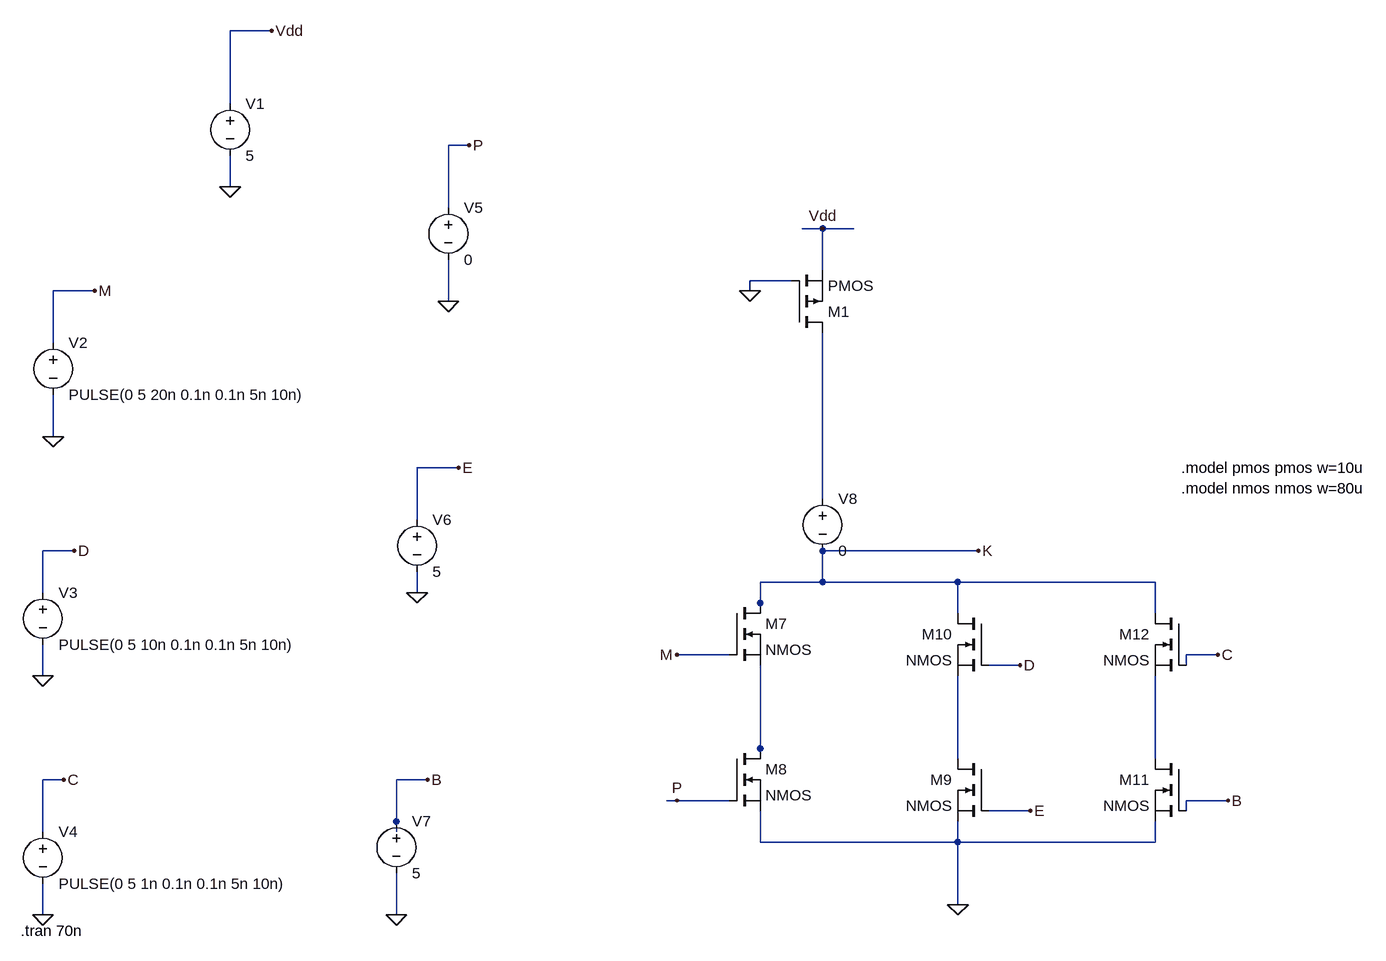
[diagram p0: schematic 5_1_2.asc]
5_1_2.asc, the LTspice schematic file:
Version 4
SHEET 1 892 808
WIRE -816 -592 -880 -592
WIRE -880 -480 -880 -592
WIRE -512 -416 -544 -416
WIRE -880 -352 -880 -400
WIRE -544 -320 -544 -416
WIRE 32 -288 0 -288
WIRE 80 -288 32 -288
WIRE 32 -224 32 -288
WIRE -16 -208 -80 -208
WIRE -1088 -192 -1152 -192
WIRE -80 -192 -80 -208
WIRE -544 -176 -544 -240
WIRE -1152 -112 -1152 -192
WIRE -1152 32 -1152 -32
WIRE -528 80 -592 80
WIRE 32 128 32 -128
WIRE -592 160 -592 80
WIRE -1120 208 -1168 208
WIRE 272 208 32 208
WIRE 32 256 32 208
WIRE 32 256 -64 256
WIRE 240 256 32 256
WIRE 544 256 240 256
WIRE -1168 272 -1168 208
WIRE -592 272 -592 240
WIRE -64 288 -64 256
WIRE -64 304 -64 288
WIRE 240 304 240 256
WIRE 544 304 544 256
WIRE -112 368 -192 368
WIRE 640 368 592 368
WIRE 336 384 288 384
WIRE 592 384 592 368
WIRE -1168 400 -1168 352
WIRE -64 512 -64 384
WIRE -64 528 -64 512
WIRE 240 528 240 400
WIRE 544 528 544 400
WIRE -1136 560 -1168 560
WIRE -576 560 -624 560
WIRE -192 592 -208 592
WIRE -112 592 -192 592
WIRE 656 592 592 592
WIRE 352 608 288 608
WIRE 592 608 592 592
WIRE -624 624 -624 560
WIRE -1168 640 -1168 560
WIRE -624 640 -624 624
WIRE -64 656 -64 608
WIRE 240 656 240 624
WIRE 240 656 -64 656
WIRE 544 656 544 624
WIRE 544 656 240 656
WIRE 240 752 240 656
WIRE -1168 768 -1168 720
WIRE -624 768 -624 704
FLAG 240 752 0
FLAG 272 208 Κ
FLAG -192 368 Μ
FLAG -192 592 P
FLAG 336 384 D
FLAG 352 608 E
FLAG 640 368 C
FLAG 656 592 B
FLAG -816 -592 Vdd
FLAG -880 -352 0
FLAG -1088 -192 M
FLAG -512 -416 P
FLAG -1120 208 D
FLAG -528 80 E
FLAG -1136 560 C
FLAG -576 560 B
FLAG -1168 768 0
FLAG -624 768 0
FLAG -592 272 0
FLAG -1168 400 0
FLAG -1152 32 0
FLAG -544 -176 0
FLAG 32 -288 Vdd
FLAG -80 -192 0
SYMBOL nmos -112 288 R0
SYMATTR InstName M7
SYMBOL nmos -112 512 R0
SYMATTR InstName M8
SYMBOL nmos 288 528 M0
SYMATTR InstName M9
SYMBOL nmos 288 304 M0
SYMATTR InstName M10
SYMBOL nmos 592 528 M0
SYMATTR InstName M11
SYMBOL nmos 592 304 M0
SYMATTR InstName M12
SYMBOL voltage -880 -496 R0
WINDOW 123 0 0 Left 0
WINDOW 39 0 0 Left 0
SYMATTR InstName V1
SYMATTR Value 5
SYMBOL voltage -1152 -128 R0
WINDOW 123 0 0 Left 0
WINDOW 39 0 0 Left 0
SYMATTR InstName V2
SYMATTR Value PULSE(0 5 20n 0.1n 0.1n 5n 10n)
SYMBOL voltage -1168 256 R0
WINDOW 123 0 0 Left 0
WINDOW 39 0 0 Left 0
SYMATTR InstName V3
SYMATTR Value PULSE(0 5 10n 0.1n 0.1n 5n 10n)
SYMBOL voltage -1168 624 R0
WINDOW 123 0 0 Left 0
WINDOW 39 0 0 Left 0
SYMATTR InstName V4
SYMATTR Value PULSE(0 5 1n 0.1n 0.1n 5n 10n)
SYMBOL voltage -544 -336 R0
WINDOW 123 0 0 Left 0
WINDOW 39 0 0 Left 0
SYMATTR InstName V5
SYMATTR Value 0
SYMBOL voltage -592 144 R0
WINDOW 123 0 0 Left 0
WINDOW 39 0 0 Left 0
SYMATTR InstName V6
SYMATTR Value 5
SYMBOL voltage -624 608 R0
WINDOW 123 0 0 Left 0
WINDOW 39 0 0 Left 0
SYMATTR InstName V7
SYMATTR Value 5
SYMBOL voltage 32 112 R0
WINDOW 123 0 0 Left 0
WINDOW 39 0 0 Left 0
SYMATTR InstName V8
SYMATTR Value 0
SYMBOL pmos -16 -128 M180
SYMATTR InstName M1
TEXT -1202 792 Left 2 !.tran 70n
TEXT 584 80 Left 2 !.model pmos pmos w=10u\n.model nmos nmos w=80u

The netlist it stands for:
* 5_1_2.asc
M7 Κ Μ N002 N002 NMOS
M8 N002 P 0 0 NMOS
M9 N003 E 0 0 NMOS
M10 Κ D N003 N003 NMOS
M11 N004 B 0 0 NMOS
M12 Κ C N004 N004 NMOS
V1 Vdd 0 5
V2 M 0 PULSE(0 5 20n 0.1n 0.1n 5n 10n)
V3 D 0 PULSE(0 5 10n 0.1n 0.1n 5n 10n)
V4 C 0 PULSE(0 5 1n 0.1n 0.1n 5n 10n)
V5 P 0 0
V6 E 0 5
V7 B 0 5
V8 N001 Κ 0
M1 N001 0 Vdd Vdd PMOS
.model NMOS NMOS
.model PMOS PMOS
.lib standard.mos
.tran 70n
.model pmos pmos w=10u
.model nmos nmos w=80u
.backanno
.end